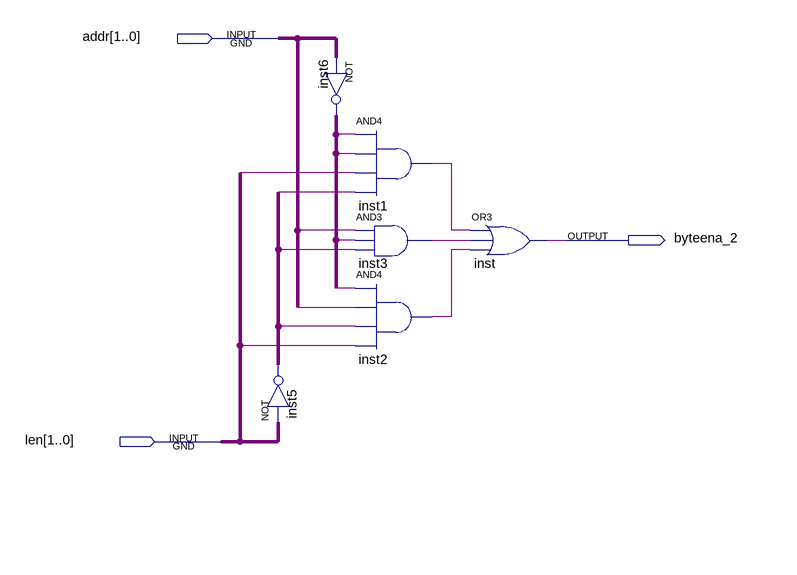
[diagram p0: schematic sheet]
// Quartus schematic byteena_2.bdf as structural Verilog: 6 symbols, 3 pins
module byteena_2 (
  input  [1:0] addr,
  input  [1:0] len,
  output byteena_2
);

  wire inst1_out, inst2_out, inst3_out;
  wire [1:0] na, nl;

  assign nl = ~len;  // NOT inst5, 2 bits wide
  assign na = ~addr;  // NOT inst6, 2 bits wide
  and inst1 (inst1_out, na[1], na[0], len[1], nl[0]);
  and inst3 (inst3_out, addr[1], na[0], nl[1]);
  and inst2 (inst2_out, na[1], addr[0], nl[1], len[0]);
  or inst (byteena_2, inst1_out, inst3_out, inst2_out);

  // Other names for the same wires on the sheet: a[1:0] = addr; l[1:0] = len
endmodule
